# EAGLE design botboardpro-rev4 (EAGLE 4.13)
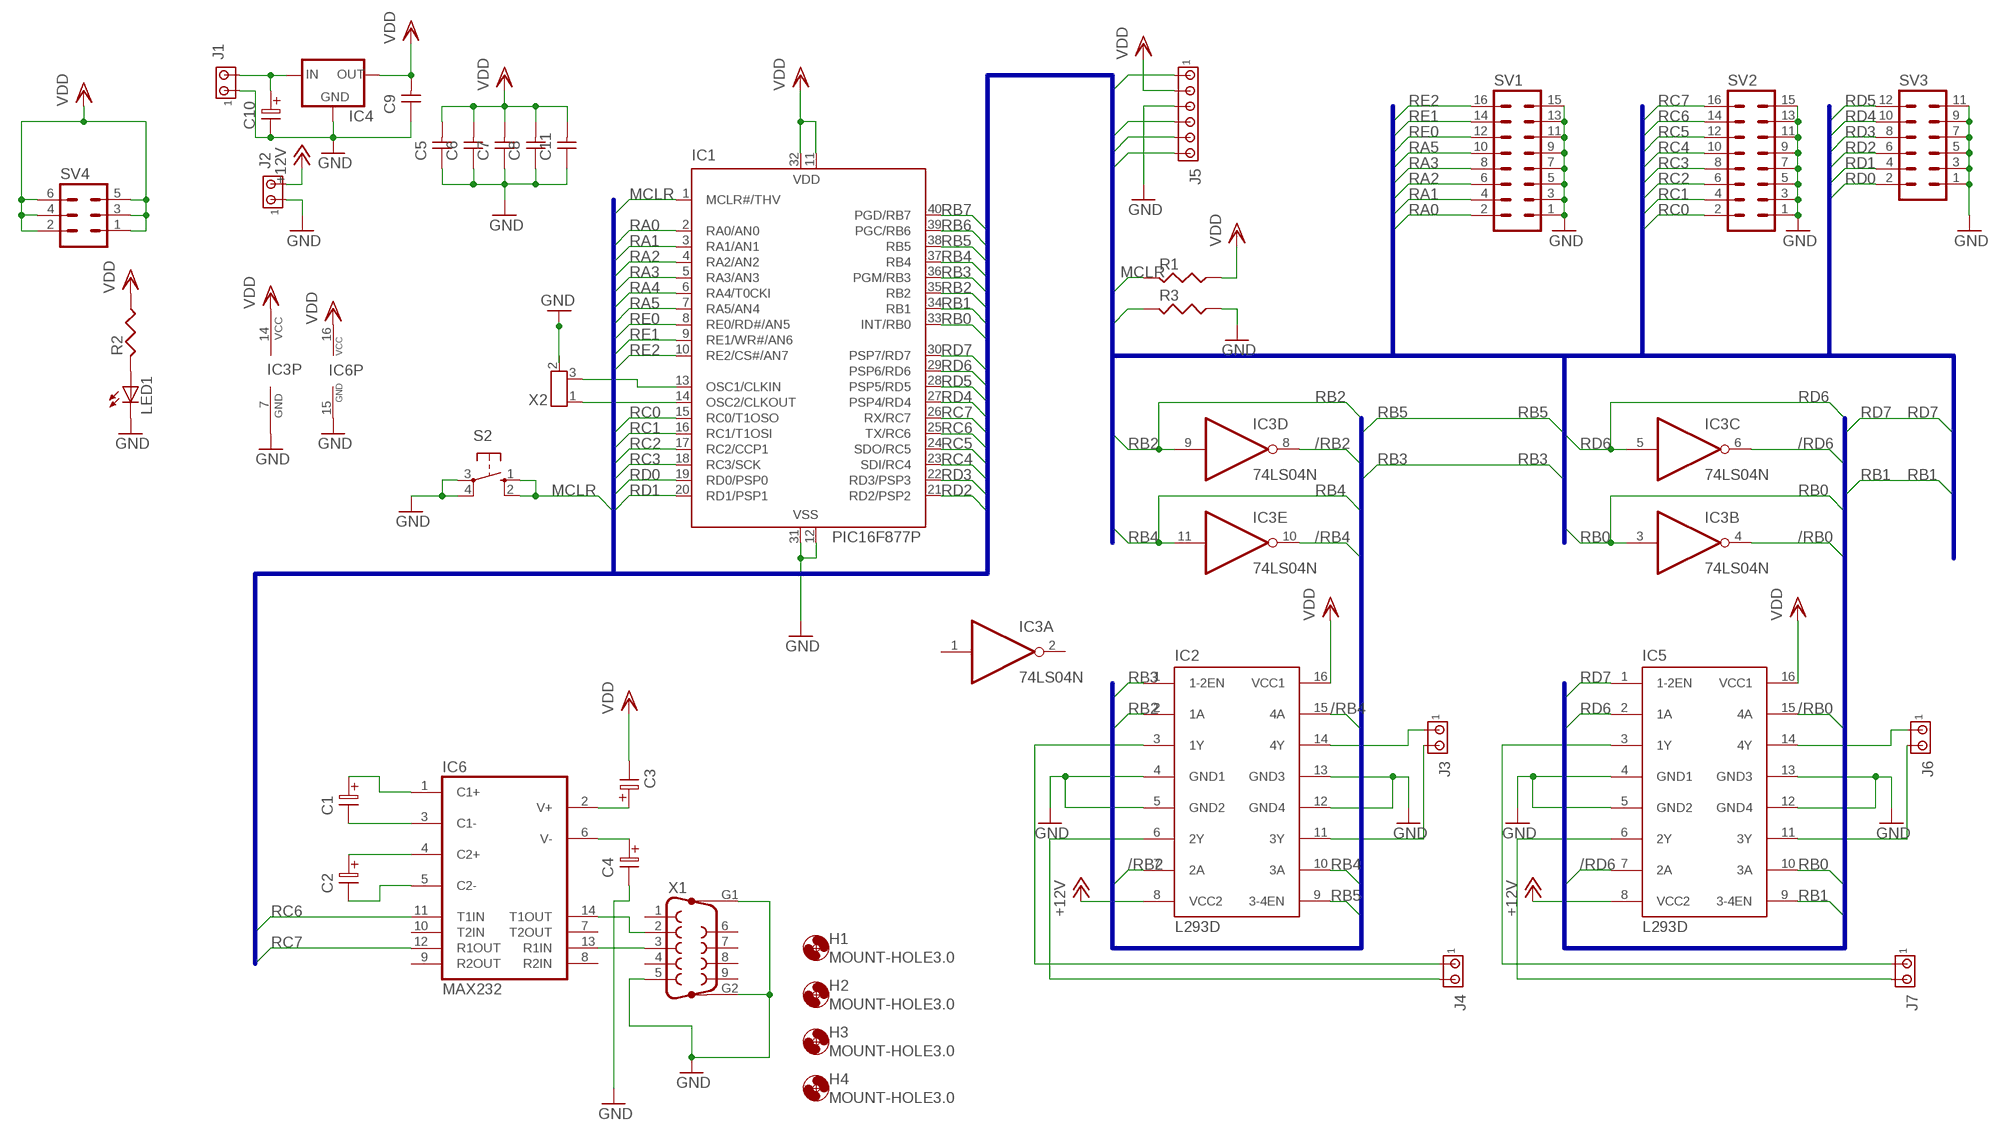
[diagram p0: schematic, sheet 1]

## Parts
C1  ELC-2,5L  [ES-2,5L]
C2  ELC-2,5L  [ES-2,5L]
C3  ELC-2,5L  [ES-2,5L]
C4  ELC-2,5L  [ES-2,5L]
C5  CAPNP-2,5  [C-2,5]
C6  CAPNP-2,5  [C-2,5]
C7  CAPNP-2,5  [C-2,5]
C8  CAPNP-2,5  [C-2,5]
C9  CAPNP-2,5  [C-2,5]
C10  ELC-2,5  [ES-2,5]
C11  CAPNP-2,5  [C-2,5]
H1  MOUNT-HOLE3.0  [3,0]
H2  MOUNT-HOLE3.0  [3,0]
H3  MOUNT-HOLE3.0  [3,0]
H4  MOUNT-HOLE3.0  [3,0]
IC1  PIC16F877P  [DIL40]
IC2  L293D  [DIL16]
IC3  74LS04N  [DIL14]
IC4  78XXS  [78XXS]
IC5  L293D  [DIL16]
IC6  MAX232  [DIL16]
J1  MTA02-100  [10X02MTA]
J2  MTA02-100  [10X02MTA]
J3  MTA02-100  [10X02MTA]
J4  MTA02-100  [10X02MTA]
J5  MTA06-100  [10X06MTA]
J6  MTA02-100  [10X02MTA]
J7  MTA02-100  [10X02MTA]
LED1  LED5MM  [LED5MM]
R1  RESUS-S2,5  [RS-2,5]
R2  RESUS-S2,5  [RS-2,5]
R3  RESUS-S2,5  [RS-2,5]
S2  10-XX  [B3F-10XX]
SV1  MA08-2  [MA08-2]
SV2  MA08-2  [MA08-2]
SV3  MA06-2  [MA06-2]
SV4  MA03-2  [MA03-2]
X1  F09HP  [F09HP]
X2  RESONZTT  [RESONZTT]

## Nets
+12V: IC2.8(VCC2) IC5.8(VCC2) J2.2
/RB0: IC3.4(B:O) IC5.15(4A)
/RB2: IC2.7(2A) IC3.8(D:O)
/RB4: IC2.15(4A) IC3.10(E:O)
/RD6: IC3.6(C:O) IC5.7(2A)
GND: C4.2 C5.1 C6.1 C7.1 C8.1 C9.1 C10.2 C11.1 IC1.12(VSS) IC1.31(VSS) IC2.4(GND1) IC2.5(GND2) IC2.12(GND4) IC2.13(GND3) IC3.7(P:GND) IC4.GND IC5.4(GND1) IC5.5(GND2) IC5.12(GND4) IC5.13(GND3) IC6.15(GND) J1.1 J2.1 J5.4 LED1.K(C) R3.1 S2.3(P) S2.4(P1) SV1.1 SV1.3 SV1.5 SV1.7 SV1.9 SV1.11 SV1.13 SV1.15 SV2.1 SV2.3 SV2.5 SV2.7 SV2.9 SV2.11 SV2.13 SV2.15 SV3.1 SV3.3 SV3.5 SV3.7 SV3.9 SV3.11 X1.5 X1.G1 X1.G2
MCLR: IC1.1(MCLR#/THV) J5.6 R1.2 S2.1(S) S2.2(S1)
N$1: C10.1 IC4.IN J1.2
N$2: IC2.14(4Y) J3.1
N$3: IC2.11(3Y) J3.2
N$4: IC2.3(1Y) J4.1
N$5: IC2.6(2Y) J4.2
N$6: IC5.14(4Y) J6.1
N$7: IC5.11(3Y) J6.2
N$8: IC5.3(1Y) J7.1
N$9: IC5.6(2Y) J7.2
N$10: IC1.14(OSC2/CLKOUT) X2.1(X1)
N$11: C2.1 IC6.4(C2+)
N$12: C2.2 IC6.5(C2-)
N$13: C1.2 IC6.3(C1-)
N$14: C1.1 IC6.1(C1+)
N$15: C3.1 IC6.2(V+)
N$16: C4.1 IC6.6(V-)
N$17: IC1.13(OSC1/CLKIN) X2.3(X2)
N$18: IC6.14(T1OUT) X1.2
N$19: IC6.13(R1IN) X1.3
N$24: LED1.A R2.2
RA0: IC1.2(RA0/AN0) SV1.2
RA1: IC1.3(RA1/AN1) SV1.4
RA2: IC1.4(RA2/AN2) SV1.6
RA3: IC1.5(RA3/AN3) SV1.8
RA4: IC1.6(RA4/T0CKI)
RA5: IC1.7(RA5/AN4) SV1.10
RB0: IC1.33(INT/RB0) IC3.3(B:I) IC5.10(3A)
RB1: IC1.34(RB1) IC5.9(3-4EN)
RB2: IC1.35(RB2) IC2.2(1A) IC3.9(D:I)
RB3: IC1.36(PGM/RB3) IC2.1(1-2EN) J5.1 R3.2
RB4: IC1.37(RB4) IC2.10(3A) IC3.11(E:I)
RB5: IC1.38(RB5) IC2.9(3-4EN)
RB6: IC1.39(PGC/RB6) J5.2
RB7: IC1.40(PGD/RB7) J5.3
RC0: IC1.15(RC0/T1OSO) SV2.2
RC1: IC1.16(RC1/T1OSI) SV2.4
RC2: IC1.17(RC2/CCP1) SV2.6
RC3: IC1.18(RC3/SCK) SV2.8
RC4: IC1.23(SDI/RC4) SV2.10
RC5: IC1.24(SDO/RC5) SV2.12
RC6: IC1.25(TX/RC6) IC6.11(T1IN) SV2.14
RC7: IC1.26(RX/RC7) IC6.12(R1OUT) SV2.16
RD0: IC1.19(RD0/PSP0) SV3.2
RD1: IC1.20(RD1/PSP1) SV3.4
RD2: IC1.21(RD2/PSP2) SV3.6
RD3: IC1.22(RD3/PSP3) SV3.8
RD4: IC1.27(PSP4/RD4) SV3.10
RD5: IC1.28(PSP5/RD5) SV3.12
RD6: IC1.29(PSP6/RD6) IC3.5(C:I) IC5.2(1A)
RD7: IC1.30(PSP7/RD7) IC5.1(1-2EN)
RE0: IC1.8(RE0/RD#/AN5) SV1.12
RE1: IC1.9(RE1/WR#/AN6) SV1.14
RE2: IC1.10(RE2/CS#/AN7) SV1.16
VDD: C3.2 C5.2 C6.2 C7.2 C8.2 C9.2 C11.2 IC1.11(VDD) IC1.32(VDD) IC2.16(VCC1) IC3.14(P:VCC) IC4.OUT IC5.16(VCC1) IC6.16(VCC) J5.5 R1.1 R2.1 SV4.1 SV4.2 SV4.3 SV4.4 SV4.5 SV4.6
Unconnected: IC3.1(A:I) IC3.2(A:O) IC3.12(F:O) IC3.13(F:I) IC6.7(T2OUT) IC6.8(R2IN) IC6.9(R2OUT) IC6.10(T2IN) X1.1 X1.4 X1.6 X1.7 X1.8 X1.9

## Buses
RA[0..5],RB[0..7],RC[0..7],RD[0..7],RE[0..2],MCLR
RB5,RB4,/RB4,RB3,RB2,/RB2
RB1,RB0,/RB0,RD7,RD6,/RD6

## Power pins joined to a net without a drawn wire
GND: X2.2(GND)

## Library data of the parts
C1-C4 = discrete:ELC-2,5L
C5-C9 C11 = discrete:CAPNP-2,5
C10 = discrete:ELC-2,5
H1-H4 = holes:MOUNT-HOLE: MOUNTING HOLE with drill center marker
IC1 = microchip:PIC16F87*: MICROCONTROLLER
IC2 IC5 = st-microelectronics:L293D: PUSH-PULL 4 CHANNEL DRIVER
IC3 = 74xx-us:74*04: Hex INVERTER
IC4 = v-reg:78XXS: VOLTAGE REGULATOR
IC6 = maxim:MAX232: RS232 TRANSEIVER
J1-J4 J6 J7 = con-amp:MTA02-100: AMP connector
J5 = con-amp:MTA06-100: AMP connector
LED1 = led:LED: LED OSRAM: - CHIPLED LG R971, LG N971, LY N971, LG Q971, LY Q971, LO R971, LY R971 LH N974, LH R974 LS Q976, LO Q976, LY Q976 LO Q996 - Hyper CHIPLED LW Q18S LB Q993, LB Q99A, LB R99A - SideLED LS A670, LO A670, LY A670, LG A670, LP A670 LB A673, LV A673, LT A673, LW A673 LH A674 LY A675 LS A676, LA A676, LO A676, LY A676, LW A676 LS A679, LY A679, LG A679 - Hyper Micro SIDELED® LS Y876, LA Y876, LO Y876, LY Y876 LT Y87S - SmartLED LW L88C, LW L88S LB L89C, LB L89S, LG L890 LS L89K, LO L89K, LY L89K LS L896, LA L896, LO L896, LY L896 - TOPLED LS T670, LO T670, LY T670, LG T670, LP T670 LSG T670, LSP T670, LSY T670, LOP T670, LYG T670 LG T671, LOG T671, LSG T671 LB T673, LV T673, LT T673, LW T673 LH T674 LS T676, LA T676, LO T676, LY T676, LB T676, LH T676, LSB T676, LW T676 LB T67C, LV T67C, LT T67C, LS T67K, LO T67K, LY T67K, LW E67C LS E67B, LA E67B, LO E67B, LY E67B, LB E67C, LV E67C, LT E67C LW T67C LS T679, LY T679, LG T679 LS T770, LO T770, LY T770, LG T770, LP T770 LB T773, LV T773, LT T773, LW T773 LH T774 LS E675, LA E675, LY E675, LS T675 LS T776, LA T776, LO T776, LY T776, LB T776 LHGB T686 LT T68C, LB T68C - Hyper Mini TOPLED® LB M676 - Mini TOPLED Santana® LG M470 LS M47K, LO M47K, LY M47K Source: http://www.osram.convergy.de/
R1-R3 = discrete:RESUS-S2,5
S2 = switch-omron:10-XX: OMRON SWITCH
SV1 SV2 = con-lstb:MA08-2: PIN HEADER
SV3 = con-lstb:MA06-2: PIN HEADER
SV4 = con-lstb:MA03-2: PIN HEADER
X1 = con-subd:F09HP: SUB-D
X2 = ADS:RESONZTT

## Board
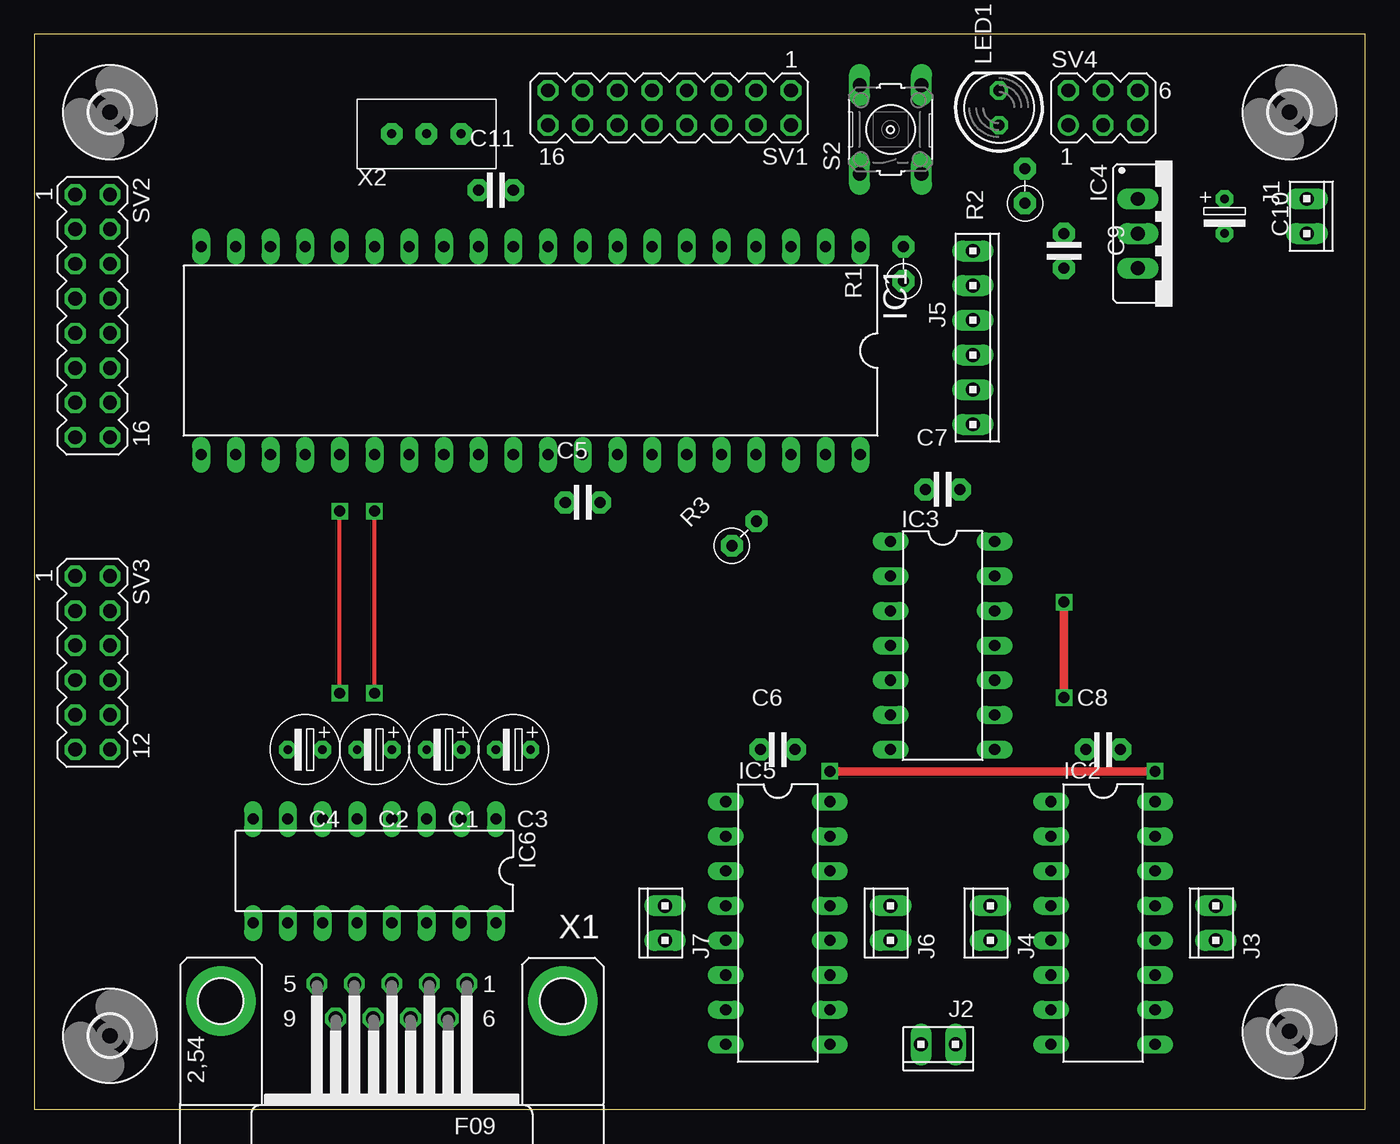
[diagram p1: board, top side]
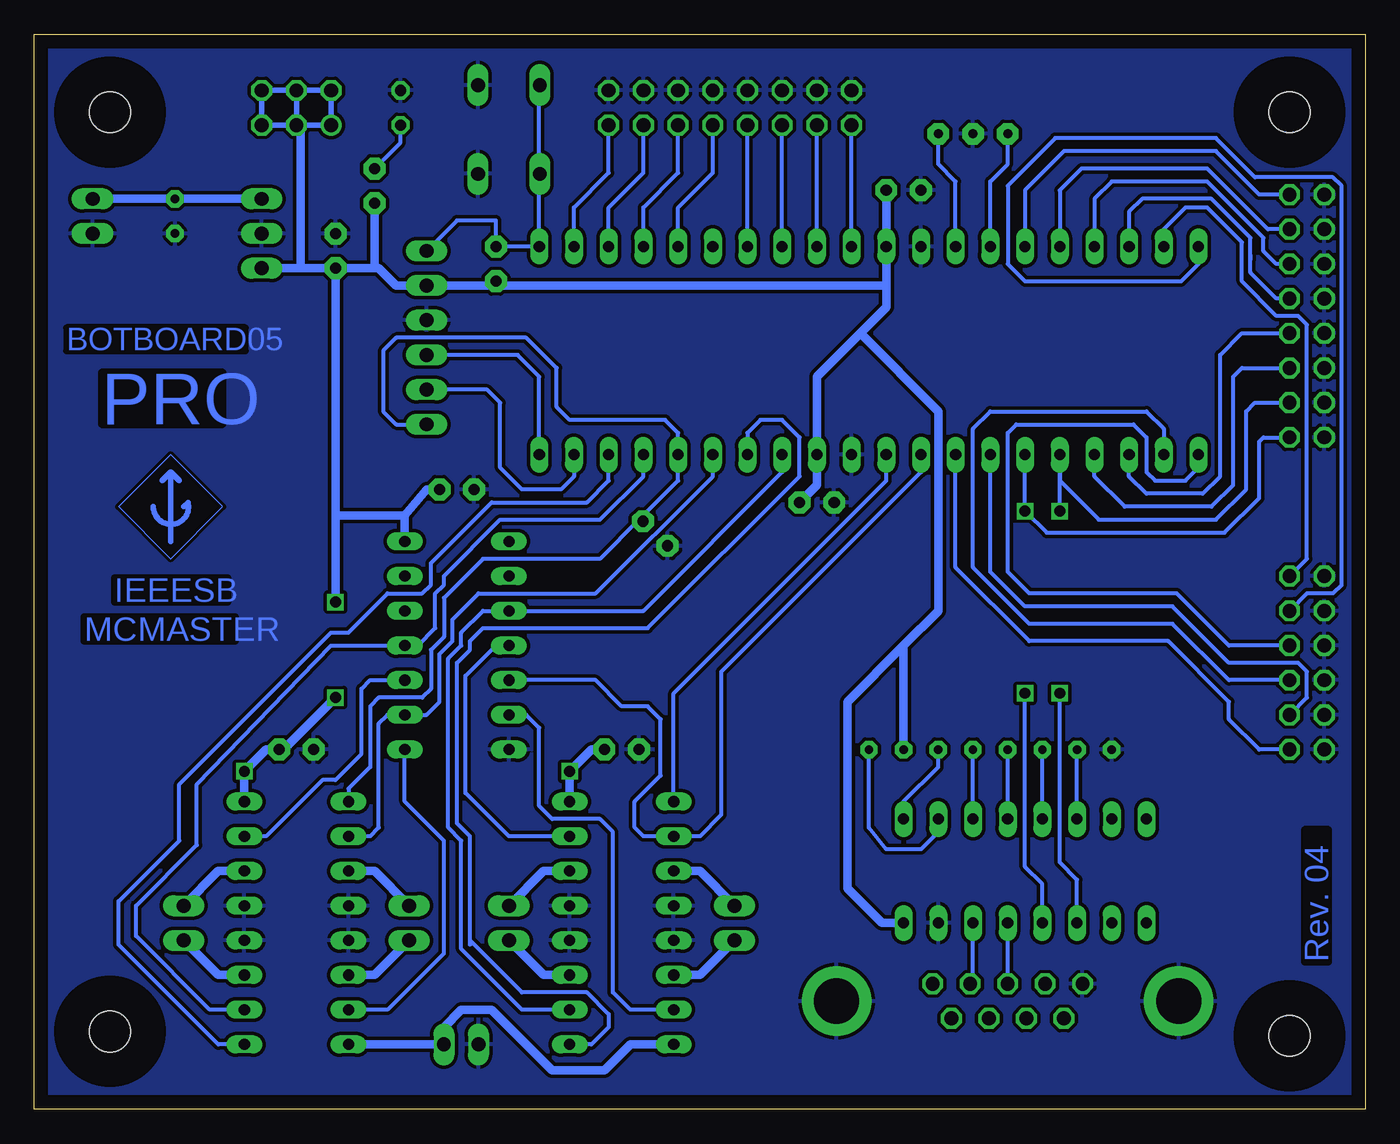
[diagram p2: board, bottom side, seen from below]

Size 97.46 x 78.73 mm. Coordinates in mm from the lower left corner, seen from the top.
Outline: 0,0 97.46,0 97.46,78.73 0,78.73 0,0
Copper layers (1*16): Top 0.035mm / dielectric 1.5mm / Bottom 0.035mm
Design rules "default": minimum track width 10mil, minimum drill 24mil, track to track 10mil, track to pad 10mil, pad to pad 10mil, via to via 10mil, smd to smd 8mil, copper to edge 40mil, drill to drill 8mil, minimum pad ring 10mil, minimum via ring 8mil, stop-mask expansion 4mil, vias tented up to drill 0mil, thermal gap 10mil

### Footprints (pad centres in the part's own frame; a part is rotated, then mirrored left to right if it is on the bottom)
ES-2,5L = drill 0.61 pad 1.27 octagon: 1 0,0; 2 2.54,0
C-2,5 = drill 0.813 pad 1.6 octagon: 1 -1.27,0; 2 1.27,0
ES-2,5 = drill 0.61 pad 1.27 octagon: 1 -1.27,0; 2 1.27,0
3,0 = hole 3: 0,0
DIL40 = drill 0.813 long: 1 -24.13,-7.62; 2 -21.59,-7.62; 3 -19.05,-7.62; 4 -16.51,-7.62; 5 -13.97,-7.62; 6 -11.43,-7.62; 7 -8.89,-7.62; 8 -6.35,-7.62; 9 -3.81,-7.62; 10 -1.27,-7.62; 11 1.27,-7.62; 12 3.81,-7.62; 13 6.35,-7.62; 14 8.89,-7.62; 15 11.43,-7.62; 16 13.97,-7.62; 17 16.51,-7.62; 18 19.05,-7.62; 19 21.59,-7.62; 20 24.13,-7.62; 21 24.13,7.62; 22 21.59,7.62; 23 19.05,7.62; 24 16.51,7.62; 25 13.97,7.62; 26 11.43,7.62; 27 8.89,7.62; 28 6.35,7.62; 29 3.81,7.62; 30 1.27,7.62; 31 -1.27,7.62; 32 -3.81,7.62; 33 -6.35,7.62; 34 -8.89,7.62; 35 -11.43,7.62; 36 -13.97,7.62; 37 -16.51,7.62; 38 -19.05,7.62; 39 -21.59,7.62; 40 -24.13,7.62
DIL16 = drill 0.813 long: 1 -8.89,-3.81; 2 -6.35,-3.81; 3 -3.81,-3.81; 4 -1.27,-3.81; 5 1.27,-3.81; 6 3.81,-3.81; 7 6.35,-3.81; 8 8.89,-3.81; 9 8.89,3.81; 10 6.35,3.81; 11 3.81,3.81; 12 1.27,3.81; 13 -1.27,3.81; 14 -3.81,3.81; 15 -6.35,3.81; 16 -8.89,3.81
DIL14 = drill 0.813 long: 1 -7.62,-3.81; 2 -5.08,-3.81; 3 -2.54,-3.81; 4 0,-3.81; 5 2.54,-3.81; 6 5.08,-3.81; 7 7.62,-3.81; 8 7.62,3.81; 9 5.08,3.81; 10 2.54,3.81; 11 0,3.81; 12 -2.54,3.81; 13 -5.08,3.81; 14 -7.62,3.81
78XXS = drill 1.016 long: GND 0,-2.54; IN -2.54,-2.54; OUT 2.54,-2.54
10X02MTA = drill 1.016 long: 1 1.27,0; 2 -1.27,0
10X06MTA = drill 1.016 long: 1 6.35,0; 2 3.81,0; 3 1.27,0; 4 -1.27,0; 5 -3.81,0; 6 -6.35,0
LED5MM = drill 0.813 octagon: A -1.27,0; K 1.27,0
RS-2,5 = drill 0.813 pad 1.6 octagon: 1 0,0; 2 2.54,0
B3F-10XX = drill 1.016 long: 1 -3.251,2.261; 2 3.251,2.261; 3 -3.251,-2.261; 4 3.251,-2.261
MA08-2 = drill 1.016 octagon: 1 -8.89,-1.27; 2 -8.89,1.27; 3 -6.35,-1.27; 4 -6.35,1.27; 5 -3.81,-1.27; 6 -3.81,1.27; 7 -1.27,-1.27; 8 -1.27,1.27; 9 1.27,-1.27; 10 1.27,1.27; 11 3.81,-1.27; 12 3.81,1.27; 13 6.35,-1.27; 14 6.35,1.27; 15 8.89,-1.27; 16 8.89,1.27
MA06-2 = drill 1.016 octagon: 1 -6.35,-1.27; 2 -6.35,1.27; 3 -3.81,-1.27; 4 -3.81,1.27; 5 -1.27,-1.27; 6 -1.27,1.27; 7 1.27,-1.27; 8 1.27,1.27; 9 3.81,-1.27; 10 3.81,1.27; 11 6.35,-1.27; 12 6.35,1.27
MA03-2 = drill 1.016 round: 1 -2.54,-1.27 | drill 1.016 octagon: 2 -2.54,1.27; 3 0,-1.27; 4 0,1.27; 5 2.54,-1.27; 6 2.54,1.27
F09HP = drill 1.016 octagon: 1 -5.486,-1.27; 2 -2.743,-1.27; 3 0,-1.27; 4 2.743,-1.27; 5 5.486,-1.27; 6 -4.115,1.27; 7 -1.372,1.27; 8 1.372,1.27; 9 4.115,1.27 | drill 3.302 pad 5.08 round: G1 -12.522,0; G2 12.522,0
RESONZTT = drill 0.66 pad 1.575 octagon: 1 0,0; 2 2.54,0; 3 5.08,0

### Placement (x,y rotation side)
C1  31.27,26.35 180 top
C2  26.19,26.35 180 top
C3  36.35,26.35 180 top
C4  21.11,26.35 180 top
C5  40.16,44.45 0 top
C6  54.45,26.35 0 top
C7  66.51,45.4 0 top
C8  78.26,26.35 0 top
C9  75.4,62.86 270 top
C10  87.15,65.4 270 top
C11  33.81,67.3 0 top
H1  5.55,5.39 0 top
H2  91.91,73.02 0 top
H3  91.91,5.71 0 top
H4  5.55,73.02 0 top
IC1  36.35,55.56 180 top
IC2  78.26,13.65 270 top
IC3  66.51,33.97 270 top
IC4  83.34,64.13 270 top
IC5  54.45,13.65 270 top
IC6  24.92,17.46 180 top
J1  93.18,65.4 270 top
J2  66.19,4.76 180 top
J3  86.51,13.65 90 top
J4  70,13.65 90 top
J5  68.73,56.51 270 top
J6  62.7,13.65 90 top
J7  46.19,13.65 90 top
LED1  70.64,73.34 90 top
R1  63.65,60.64 90 top
R2  72.54,66.35 90 top
R3  51.08,41.27 45 top
S2  62.7,71.75 90 top
SV1  46.51,73.34 180 top
SV2  4.28,58.1 270 top
SV3  4.28,32.7 270 top
SV4  78.26,73.34 0 top
X1  26.19,7.93 180 top
X2  26.19,71.43 0 top

### Tracks (layer width: path | path; a pad name or v marks a point on that pad's centre or on a via)
+12V
  Bottom 0.61: J2.2 67.14,4.76 | J2.2 IC2.8 | 50.95,4.76 IC5.8 53.81,4.76 55.72,2.85 59.52,2.85 63.97,7.3 66.19,7.3 67.46,6.03 J2.2
/RB0
  Bottom 0.305: IC3.4 63.65,33.97 65.88,31.74 65.88,23.17 62.7,20 IC5.15
/RB2
  Bottom 0.305: IC2.7 71.59,7.3 67.46,11.43 67.46,19.68 70.32,22.54 IC3.8
/RB4
  Bottom 0.305: IC2.15 80.48,20 76.35,24.12 75.4,24.12 73.5,26.03 73.5,30.79 72.86,31.43 IC3.10
/RD6
  Bottom 0.305: IC3.6 61.43,28.89 60.48,27.93 60.48,22.22 59.52,21.27 56.03,21.27 55.08,20.31 55.08,8.57 53.81,7.3 IC5.7
GND
  pour Bottom: -1.12,79.69 -1.12,-1.27 98.58,-1.27 98.58,79.69
MCLR
  Bottom 0.305: J5.6 66.51,65.08 63.65,65.08 R1.2 IC1.1 60.48,68.82 60.48,74.68
  Bottom 0.406: 60.48,74.68 S2.2 | IC1.1 60.48,62.86 | 60.48,68.82 S2.1
N$1
  Bottom 0.61: J1.2 C10.1 IC4.IN
N$2
  Bottom 0.61: IC2.14 83.97,17.46 J3.1
N$3
  Bottom 0.61: IC2.11 83.97,9.84 J3.2
N$4
  Bottom 0.61: IC2.3 72.54,17.46 J4.1
N$5
  Bottom 0.61: IC2.6 72.54,9.84 J4.2
N$6
  Bottom 0.61: IC5.14 60.16,17.46 J6.1
N$7
  Bottom 0.61: IC5.11 60.16,9.84 J6.2
N$8
  Bottom 0.61: IC5.3 48.73,17.46 J7.1
N$9
  Bottom 0.61: IC5.6 48.73,9.84 J7.2
N$10
  Bottom 0.305: IC1.14 27.46,67.94 26.19,69.21 X2.1
N$11
  Bottom 0.305: 26.19,20.95 IC6.4 C2.1
N$12
  Bottom 0.305: IC6.5 C2.2
N$13
  Bottom 0.305: 28.73,26.66 C1.2 IC6.3
N$14
  Bottom 0.305: C1.1 31.27,25.08 33.81,22.54 IC6.1
N$15
  Bottom 0.305: C3.1 36.35,20.63 35.08,19.04 32.54,19.04 31.27,20.31 IC6.2
N$16
  Bottom 0.305: IC6.6 C4.1
N$17
  Bottom 0.305: IC1.13 30,67.94 31.27,69.21 X2.3
N$18
  Bottom 0.305: X1.2 29.05,9.2 28.73,9.52 IC6.14
N$19
  Bottom 0.305: X1.3 IC6.13
N$20
  Bottom 0: 83.66,44.13 87.47,47.94 91.28,44.13 87.47,40.32 83.66,44.13
N$21
  Bottom 0.406: 87.47,41.59 87.47,46.67 | 87.47,46.67 88.1,46.03 | 87.47,46.67 86.83,46.03
N$22
  Bottom 0.406: 88.73,44.13 arc-194 86.19,44.45 86.51,44.13
N$24
  Bottom 0.305: LED1.A 70.64,70.8 R2.2
RA0
  Bottom 0.305: SV1.2 55.4,68.57 57.94,66.03 IC1.2 57.94,62.86
RA1
  Bottom 0.305: SV1.4 52.86,68.57 55.4,66.03 IC1.3
RA2
  Bottom 0.305: SV1.6 50.32,68.57 52.86,66.03 IC1.4
RA3
  Bottom 0.305: SV1.8 47.78,68.57 50.32,66.03 IC1.5
RA5
  Bottom 0.305: IC1.7 SV1.10
RB0
  Bottom 0.305: IC1.33 42.7,46.67 52.86,36.51 IC3.3 64.6,36.51 66.19,34.92 66.19,33.97 67.14,33.02 67.14,20.63 66.19,19.68 66.19,11.74 61.75,7.3 IC5.10
RB1
  Bottom 0.305: IC5.9 56.67,4.76 55.4,6.03 55.4,6.98 56.98,8.57 61.75,8.57 65.4,12.22 | 65.4,12.22 65.56,12.38 | IC1.34 45.24,49.53 44.28,50.48 42.7,50.48 41.43,49.21 41.43,46.35 52.54,35.24 64.6,35.24 65.56,34.29 65.56,33.65 66.51,32.7 66.51,20.95 65.56,20 65.56,12.06 65.4,12.22 | 65.4,12.22
RB2
  Bottom 0.305: IC1.35 47.78,46.35 56.35,37.78 64.92,37.78 66.83,35.87 66.83,34.29 67.78,33.33 67.78,29.84 68.73,28.89 IC3.9 71.59,28.89 72.22,28.25 72.22,20.63 72.86,20 IC2.2
RB3
  Bottom 0.305: IC2.1 74.45,23.49 72.86,25.08 72.86,29.52 72.22,30.16 69.05,30.16 68.42,30.79 68.42,33.65 67.46,34.6 67.46,37.46 64.6,40.32 56.03,40.32 53.17,43.18 | 53.02,43.33 50.32,46.03 IC1.36 | 53.17,43.18 53.02,43.33 | J5.1 70.95,50.16 71.91,51.11 71.91,55.56 70.95,56.51 61.43,56.51 59.21,54.29 59.21,51.43 58.26,50.48 51.27,50.48 50.32,49.53 IC1.36 | IC1.36 50.63,47.94 50.32,48.26 | 53.02,43.33 53.17,43.18 | 53.02,43.33 | R3.2 52.88,43.2 53.02,43.33
RB4
  Bottom 0.305: IC2.10 84.61,7.3 90,12.7 90,14.92 85.56,19.36 85.56,23.81 75.72,33.97 IC3.11 69.37,33.97 68.1,35.24 68.1,37.78 67.46,38.41 67.46,39.05 63.34,43.18 56.03,43.18 52.86,46.35 IC1.37
RB5
  Bottom 0.305: IC1.38 55.4,46.03 56.98,44.45 63.97,44.45 68.42,40 68.42,38.41 69.05,37.78 71.59,37.78 74.45,34.92 75.72,34.92 86.83,23.81 86.83,19.68 91.28,15.24 91.28,12.06 83.97,4.76 IC2.9
RB6
  Bottom 0.305: IC1.39 57.94,46.35 58.89,45.4 61.75,45.4 63.34,46.98 63.34,51.75 64.29,52.7 J5.2
RB7
  Bottom 0.305: J5.3 62.06,55.24 60.48,53.65 IC1.40
RC0
  Bottom 0.305: IC1.15 24.92,67.3 22.06,70.16 10.95,70.16 7.77,66.99 SV2.2
RC1
  Bottom 0.305: IC1.16 22.38,67.3 20.79,68.89 11.58,68.89 7.14,64.45 SV2.4
RC2
  Bottom 0.305: IC1.17 19.84,66.67 18.57,67.94 11.58,67.94 7.46,63.81 7.46,62.86 6.5,61.91 SV2.6
RC3
  Bottom 0.305: IC1.18 17.3,65.72 16.34,66.67 11.27,66.67 8.41,63.81 8.41,62.54 | 8.41,62.54 8.41,62.23 | SV2.8 6.5,59.37 8.41,61.27 8.41,62.54
RC4
  Bottom 0.305: IC1.23 17.3,46.35 16.03,45.08 11.9,45.08 10.63,46.35 10.63,55.24 9.04,56.83 SV2.10
RC5
  Bottom 0.305: SV2.12 9.04,54.29 9.68,53.65 9.68,45.72 11.27,44.13 17.62,44.13 19.84,46.35 IC1.24
RC6  (via drill 0.8)
  Top 0.305: v22.38,30.47 v22.38,43.81
  Bottom 0.305: IC6.11 21.11,16.82 22.38,18.09 v22.38,30.47 | SV2.14 8.09,51.75 8.72,51.11 8.72,45.4 10.95,43.18 19.52,43.18 22.38,46.03 IC1.25 v22.38,43.81
RC7  (via drill 0.8)
  Top 0.305: v24.92,30.47 v24.92,43.81
  Bottom 0.305: 23.65,13.33 IC6.12 23.65,16.5 24.92,17.77 v24.92,30.47 | SV2.16 7.46,49.21 7.77,48.89 7.77,44.76 10.31,42.22 23.33,42.22 v24.92,43.81 IC1.26 24.92,48.26
RD0
  Bottom 0.305: IC1.19 14.76,64.45 13.17,66.03 11.58,66.03 9.04,63.5 9.04,60.64 6.5,58.1 4.92,58.1 4.28,57.46 4.28,40.32 SV3.2 5.55,38.73
RD1
  Bottom 0.305: IC1.20 12.22,61.91 13.49,60.64 24.92,60.64 26.19,61.91 26.19,67.62 22.7,71.11 10.95,71.11 8.09,68.26 2.38,68.26 1.74,67.62 1.74,38.41 2.38,37.78 4.28,37.78 SV3.4
RD2
  Bottom 0.305: IC1.21 12.22,46.98 13.17,46.03 15.39,46.03 16.03,46.67 16.03,49.21 16.98,50.16 25.55,50.16 26.19,49.53 26.19,39.37 24.6,37.78 13.8,37.78 10,33.97 SV3.6 5.23,33.97
RD3
  Bottom 0.305: IC1.22 14.76,49.84 16.03,51.11 27.46,51.11 28.73,49.84 28.73,39.68 24.6,35.55 14.12,35.55 10,31.43 SV3.8
RD4
  Bottom 0.305: IC1.27 27.46,39.37 24.92,36.83 14.12,36.83 10,32.7 4.92,32.7 4.28,32.06 4.28,30.16 SV3.10
RD5
  Bottom 0.305: IC1.28 30,39.68 24.6,34.29 14.44,34.29 10,29.84 10,28.57 7.77,26.35 SV3.12 5.23,26.35
RD6
  Bottom 0.305: IC5.2 50.32,20 | IC1.29 32.54,46.67 47.14,32.06 47.14,21.58 48.73,20 IC5.2 | IC3.5 56.35,31.43 54.45,29.52 52.54,29.52 51.59,28.57 51.59,24.44 53.49,22.54 53.49,20.63 52.86,20 IC5.2
RD7
  Bottom 0.305: IC1.30 35.08,46.03 50.63,30.47 IC5.1
RE0
  Bottom 0.305: IC1.8 SV1.12
RE1
  Bottom 0.305: IC1.9 SV1.14
RE2
  Bottom 0.305: IC1.10 SV1.16
VDD  (via drill 0.8)
  Top 0.61: v82.07,24.76 v58.26,24.76 | v75.4,37.14 v75.4,30.16
  Bottom 0.305: 79.53,26.03 C8.2 | 64.6,60.32 R1.1
  Bottom 0.406: 40.16,53.65 IC1.32 40.16,45.72 | SV4.4 SV4.6 SV4.5 | SV4.4 SV4.2 SV4.1 77.94,72.07 SV4.3 | SV4.4 78.26,74.92 | SV4.3 SV4.4 | SV4.3 SV4.5 | SV4.3 SV4.5
  Bottom 0.61: C8.2 80.48,26.35 v82.07,24.76 IC2.16 | IC5.16 v58.26,24.76 56.67,26.35 C6.2 | C7.2 68.73,45.4 70.32,43.49 | 70.32,43.49 IC3.14 | 75.4,43.49 v75.4,37.14 | C9.2 75.4,43.49 | 35.08,60.32 IC1.11 C11.2 | C9.2 77.94,61.59 | 77.94,61.59 IC4.OUT | 72.54,61.59 72.22,61.59 70.95,60.32 J5.5 64.6,60.32 35.08,60.32 | 72.54,61.59 C9.2 | C5.2 40.16,45.72 40.16,53.65 36.98,56.83 | 36.98,56.83 35.08,58.73 35.08,60.32 | v75.4,30.16 79.53,26.03 | 33.81,33.97 C3.2 | 33.81,33.97 31.27,36.51 31.27,51.11 36.98,56.83 | IC6.16 35.4,13.65 37.94,16.19 37.94,29.84 33.81,33.97 | 75.4,43.49 70.32,43.49 | 77.94,61.59 77.94,72.07 | 72.54,61.59 R2.1

### Text on the board
Bottom: BOTBOARD05 | PRO | IEEESB | MCMASTER | Rev. 04